# EAGLE schematic FlatSat_Final (EAGLE 9.6.2)
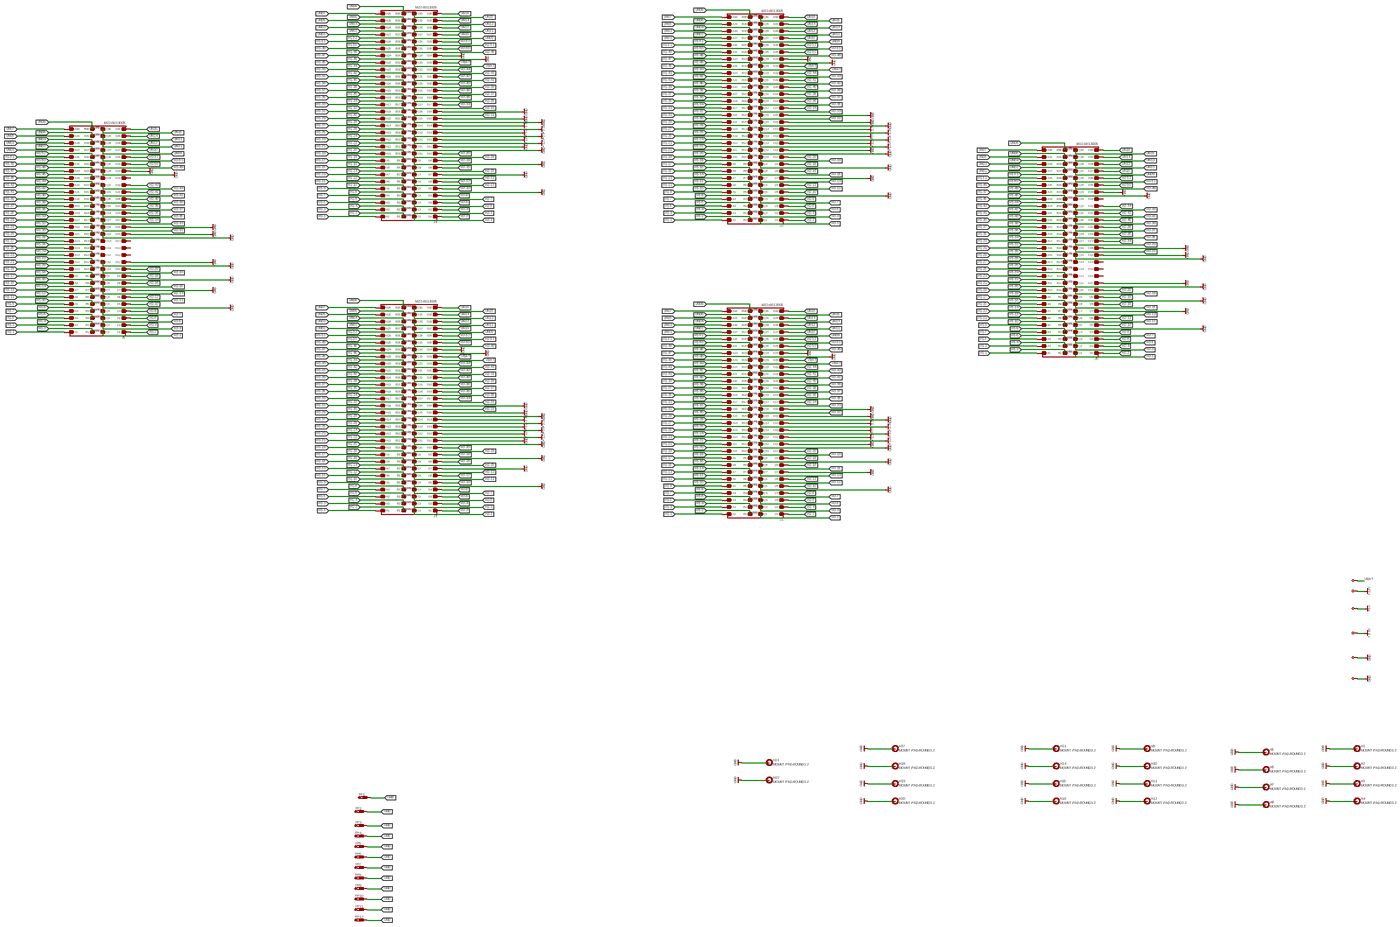
[diagram p0: schematic, sheet 1, overview]
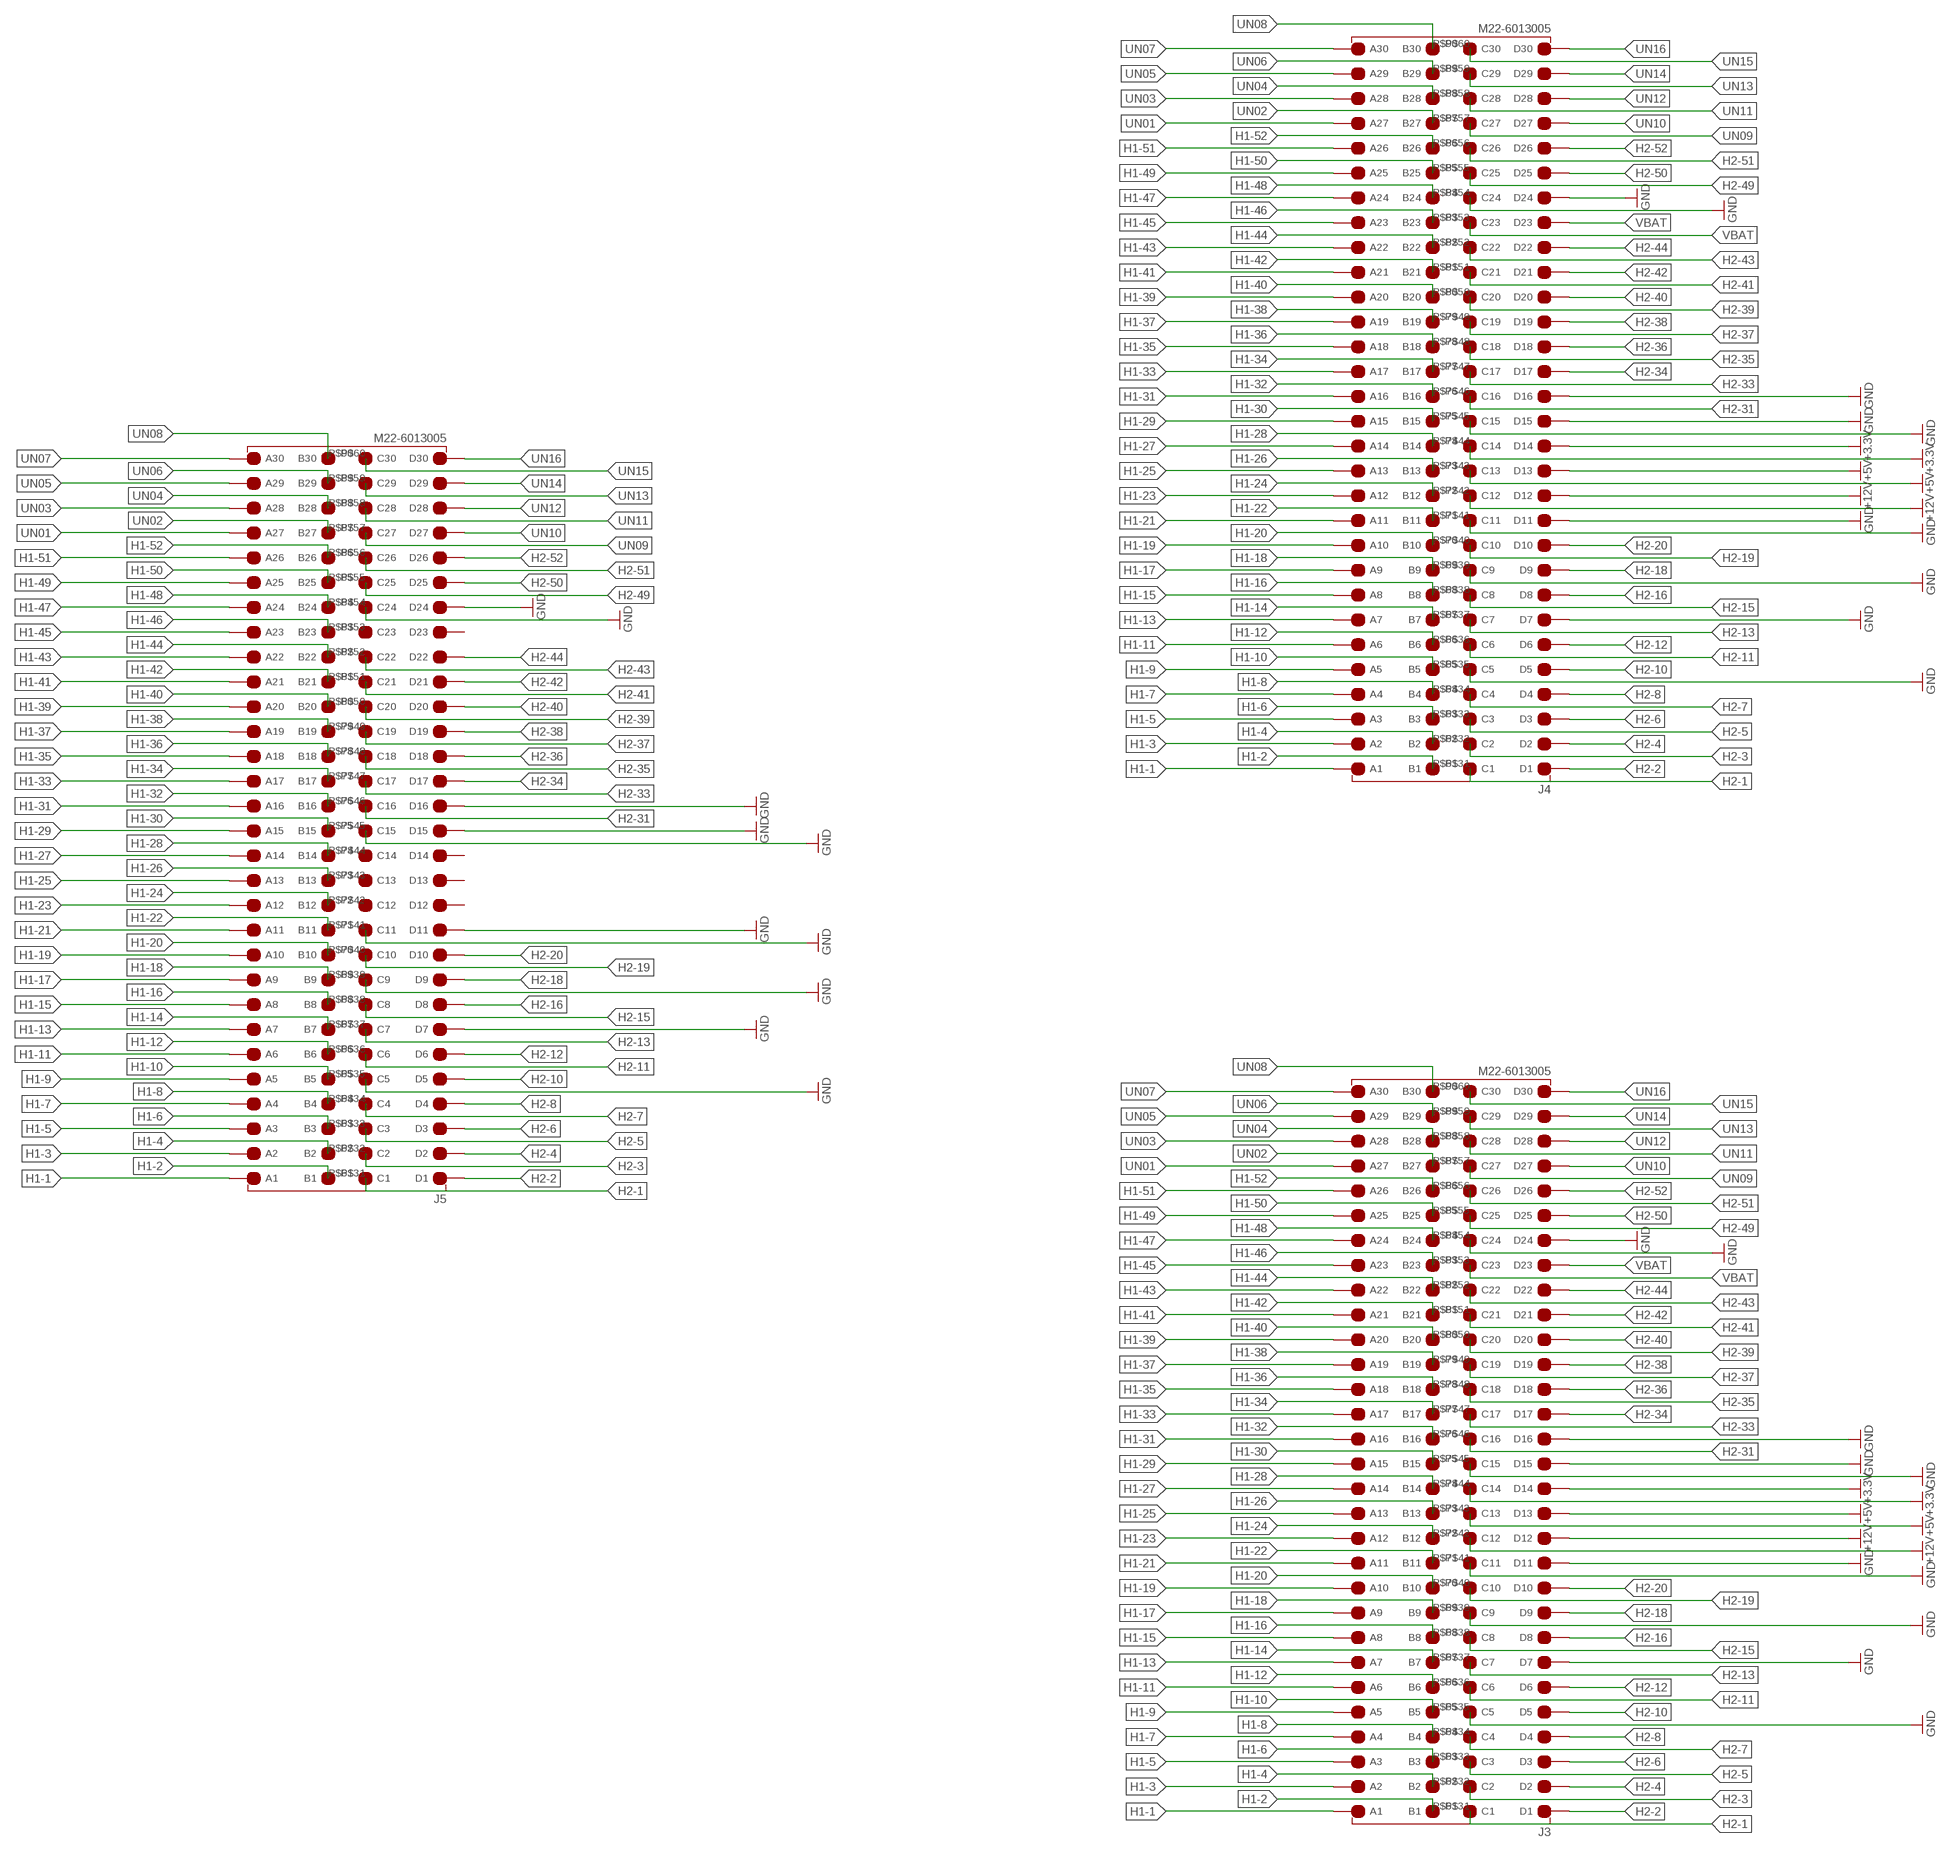
[diagram p1: schematic, sheet 1, part 1 of 5]
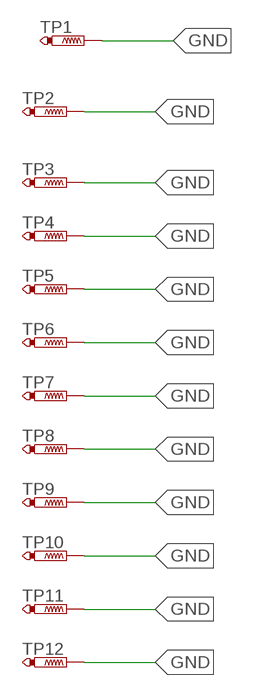
[diagram p2: schematic, sheet 1, part 2 of 5]
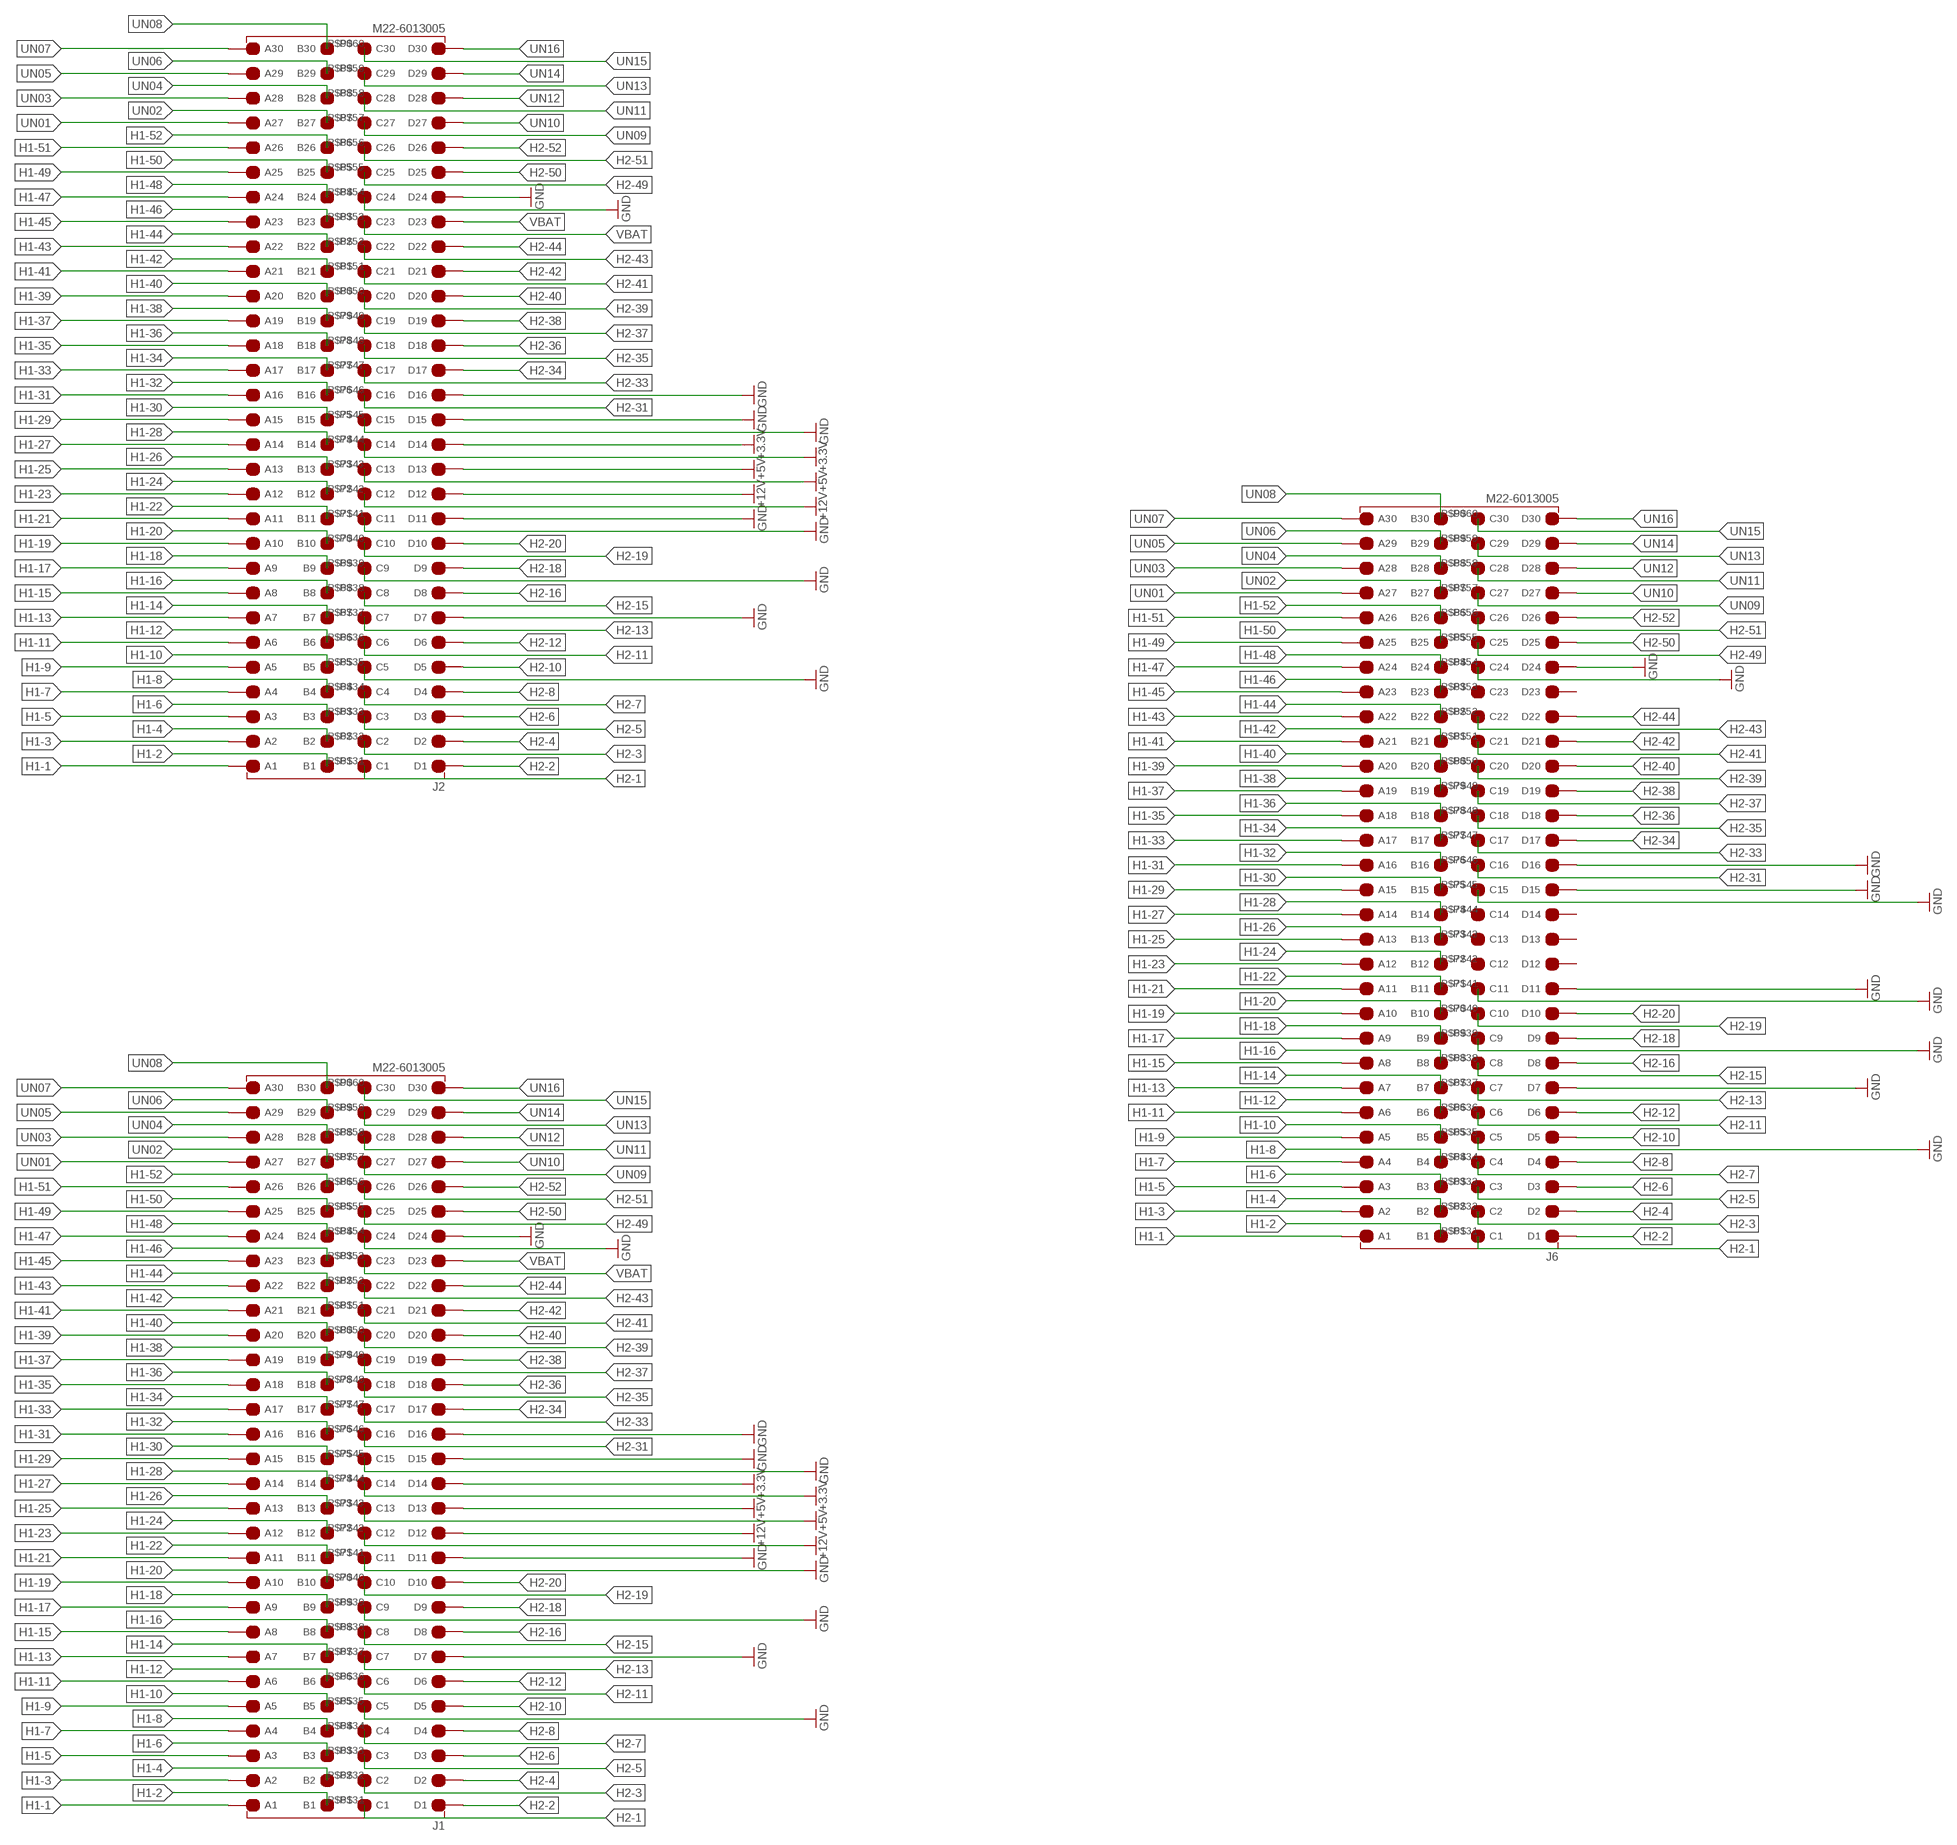
[diagram p3: schematic, sheet 1, part 3 of 5]
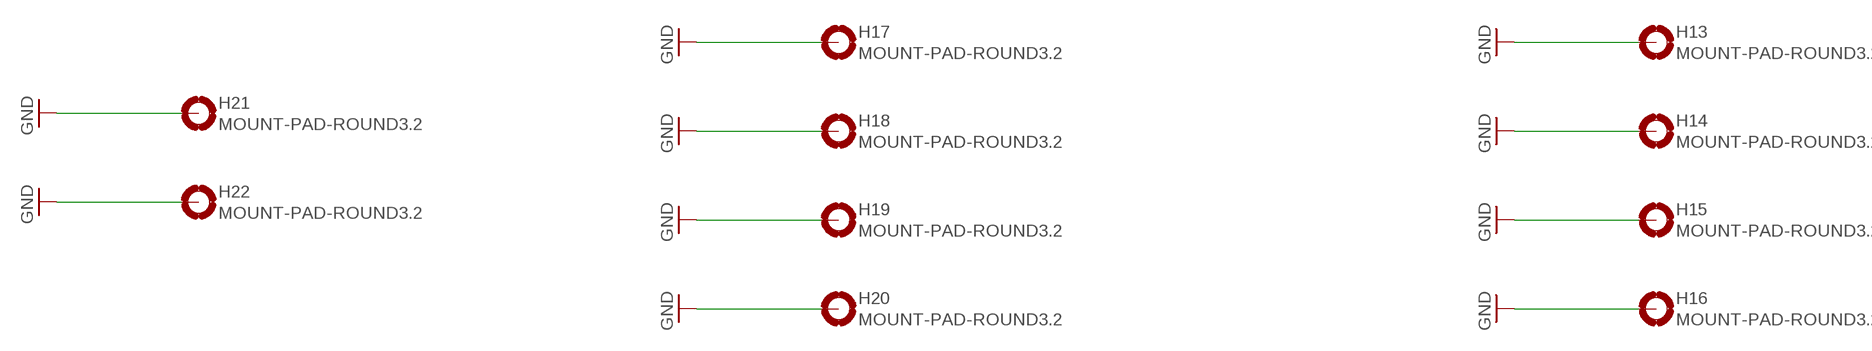
[diagram p4: schematic, sheet 1, part 4 of 5]
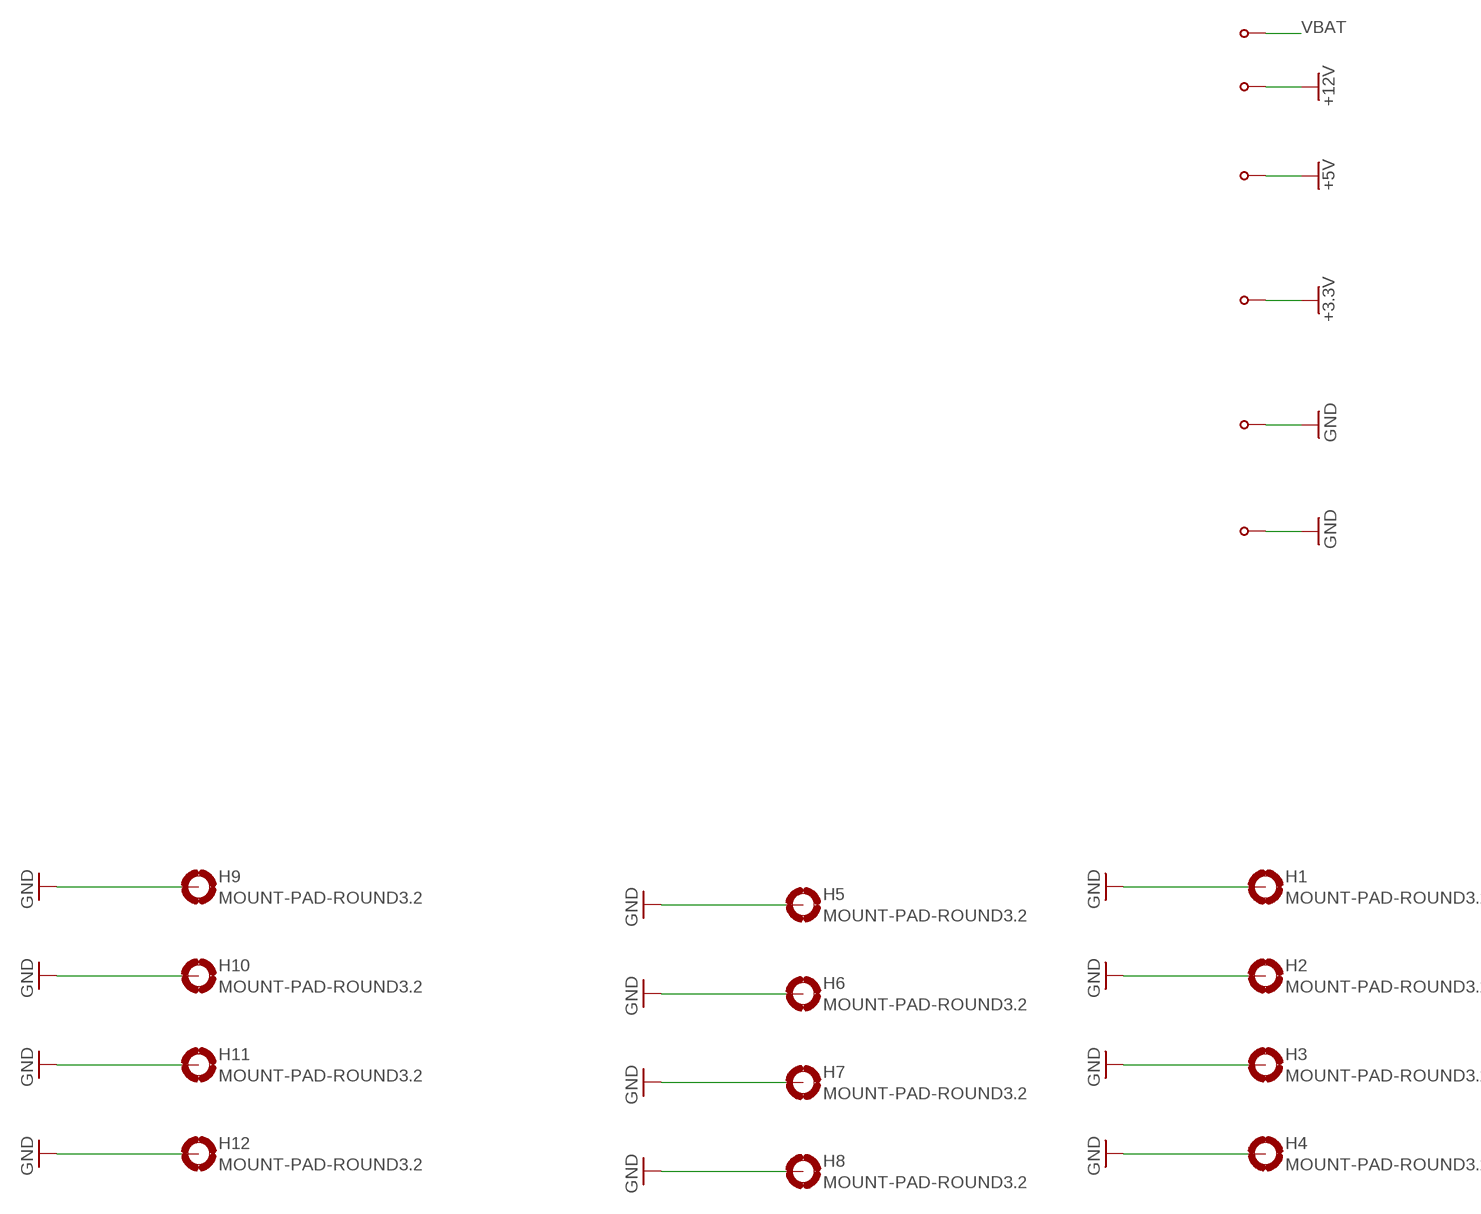
[diagram p5: schematic, sheet 1, part 5 of 5]

## Parts
H1  MOUNT-PAD-ROUND3.2  [3,2-PAD]
H2  MOUNT-PAD-ROUND3.2  [3,2-PAD]
H3  MOUNT-PAD-ROUND3.2  [3,2-PAD]
H4  MOUNT-PAD-ROUND3.2  [3,2-PAD]
H5  MOUNT-PAD-ROUND3.2  [3,2-PAD]
H6  MOUNT-PAD-ROUND3.2  [3,2-PAD]
H7  MOUNT-PAD-ROUND3.2  [3,2-PAD]
H8  MOUNT-PAD-ROUND3.2  [3,2-PAD]
H9  MOUNT-PAD-ROUND3.2  [3,2-PAD]
H10  MOUNT-PAD-ROUND3.2  [3,2-PAD]
H11  MOUNT-PAD-ROUND3.2  [3,2-PAD]
H12  MOUNT-PAD-ROUND3.2  [3,2-PAD]
H13  MOUNT-PAD-ROUND3.2  [3,2-PAD]
H14  MOUNT-PAD-ROUND3.2  [3,2-PAD]
H15  MOUNT-PAD-ROUND3.2  [3,2-PAD]
H16  MOUNT-PAD-ROUND3.2  [3,2-PAD]
H17  MOUNT-PAD-ROUND3.2  [3,2-PAD]
H18  MOUNT-PAD-ROUND3.2  [3,2-PAD]
H19  MOUNT-PAD-ROUND3.2  [3,2-PAD]
H20  MOUNT-PAD-ROUND3.2  [3,2-PAD]
H21  MOUNT-PAD-ROUND3.2  [3,2-PAD]
H22  MOUNT-PAD-ROUND3.2  [3,2-PAD]
J1  M22-6013005  [RHDR120W55P200_4X30_6020X820X9]
J2  M22-6013005  [RHDR120W55P200_4X30_6020X820X9]
J3  M22-6013005  [RHDR120W55P200_4X30_6020X820X9]
J4  M22-6013005  [RHDR120W55P200_4X30_6020X820X9]
J5  M22-6013005  [RHDR120W55P200_4X30_6020X820X9]
J6  M22-6013005  [RHDR120W55P200_4X30_6020X820X9]
TP1  PTR1PAD1-13  [P1-13]
TP2  PTR1PAD1-13  [P1-13]
TP3  PTR1PAD1-13  [P1-13]
TP4  PTR1PAD1-13  [P1-13]
TP5  PTR1PAD1-13  [P1-13]
TP6  PTR1PAD1-13  [P1-13]
TP7  PTR1PAD1-13  [P1-13]
TP8  PTR1PAD1-13  [P1-13]
TP9  PTR1PAD1-13  [P1-13]
TP10  PTR1PAD1-13  [P1-13]
TP11  PTR1PAD1-13  [P1-13]
TP12  PTR1PAD1-13  [P1-13]
U$1  BANANA-JACK  [BANANA-PRINT]
U$2  BANANA-JACK  [BANANA-PRINT]
U$3  BANANA-JACK  [BANANA-PRINT]
U$4  BANANA-JACK  [BANANA-PRINT]
U$5  BANANA-JACK  [BANANA-PRINT]
U$6  BANANA-JACK  [BANANA-PRINT]

## Nets
+3.3V: J1.P$14(D14) J1.P$44(C14) J2.P$14(D14) J2.P$44(C14) J3.P$14(D14) J3.P$44(C14) J4.P$14(D14) J4.P$44(C14) U$3.P$1(PIN)
+5V: J1.P$13(D13) J1.P$43(C13) J2.P$13(D13) J2.P$43(C13) J3.P$13(D13) J3.P$43(C13) J4.P$13(D13) J4.P$43(C13) U$2.P$1(PIN)
+12V: J1.P$12(D12) J1.P$42(C12) J2.P$12(D12) J2.P$42(C12) J3.P$12(D12) J3.P$42(C12) J4.P$12(D12) J4.P$42(C12) U$1.P$1(PIN)
GND: H1.B3,2(MOUNT) H2.B3,2(MOUNT) H3.B3,2(MOUNT) H4.B3,2(MOUNT) H5.B3,2(MOUNT) H6.B3,2(MOUNT) H7.B3,2(MOUNT) H8.B3,2(MOUNT) H9.B3,2(MOUNT) H10.B3,2(MOUNT) H11.B3,2(MOUNT) H12.B3,2(MOUNT) H13.B3,2(MOUNT) H14.B3,2(MOUNT) H15.B3,2(MOUNT) H16.B3,2(MOUNT) H17.B3,2(MOUNT) H18.B3,2(MOUNT) H19.B3,2(MOUNT) H20.B3,2(MOUNT) H21.B3,2(MOUNT) H22.B3,2(MOUNT) J1.P$7(D7) J1.P$11(D11) J1.P$15(D15) J1.P$16(D16) J1.P$24(D24) J1.P$35(C5) J1.P$39(C9) J1.P$41(C11) J1.P$45(C15) J1.P$54(C24) J2.P$7(D7) J2.P$11(D11) J2.P$15(D15) J2.P$16(D16) J2.P$24(D24) J2.P$35(C5) J2.P$39(C9) J2.P$41(C11) J2.P$45(C15) J2.P$54(C24) J3.P$7(D7) J3.P$11(D11) J3.P$15(D15) J3.P$16(D16) J3.P$24(D24) J3.P$35(C5) J3.P$39(C9) J3.P$41(C11) J3.P$45(C15) J3.P$54(C24) J4.P$7(D7) J4.P$11(D11) J4.P$15(D15) J4.P$16(D16) J4.P$24(D24) J4.P$35(C5) J4.P$39(C9) J4.P$41(C11) J4.P$45(C15) J4.P$54(C24) J5.P$7(D7) J5.P$11(D11) J5.P$15(D15) J5.P$16(D16) J5.P$24(D24) J5.P$35(C5) J5.P$39(C9) J5.P$41(C11) J5.P$45(C15) J5.P$54(C24) J6.P$7(D7) J6.P$11(D11) J6.P$15(D15) J6.P$16(D16) J6.P$24(D24) J6.P$35(C5) J6.P$39(C9) J6.P$41(C11) J6.P$45(C15) J6.P$54(C24) TP1.TP TP2.TP TP3.TP TP4.TP TP5.TP TP6.TP TP7.TP TP8.TP TP9.TP TP10.TP TP11.TP TP12.TP U$4.P$1(PIN) U$5.P$1(PIN)
H1-1: J1.P$91(A1) J2.P$91(A1) J3.P$91(A1) J4.P$91(A1) J5.P$91(A1) J6.P$91(A1)
H1-2: J1.P$61(B1) J2.P$61(B1) J3.P$61(B1) J4.P$61(B1) J5.P$61(B1) J6.P$61(B1)
H1-3: J1.P$92(A2) J2.P$92(A2) J3.P$92(A2) J4.P$92(A2) J5.P$92(A2) J6.P$92(A2)
H1-4: J1.P$62(B2) J2.P$62(B2) J3.P$62(B2) J4.P$62(B2) J5.P$62(B2) J6.P$62(B2)
H1-5: J1.P$93(A3) J2.P$93(A3) J3.P$93(A3) J4.P$93(A3) J5.P$93(A3) J6.P$93(A3)
H1-6: J1.P$63(B3) J2.P$63(B3) J3.P$63(B3) J4.P$63(B3) J5.P$63(B3) J6.P$63(B3)
H1-7: J1.P$94(A4) J2.P$94(A4) J3.P$94(A4) J4.P$94(A4) J5.P$94(A4) J6.P$94(A4)
H1-8: J1.P$64(B4) J2.P$64(B4) J3.P$64(B4) J4.P$64(B4) J5.P$64(B4) J6.P$64(B4)
H1-9: J1.P$95(A5) J2.P$95(A5) J3.P$95(A5) J4.P$95(A5) J5.P$95(A5) J6.P$95(A5)
H1-10: J1.P$65(B5) J2.P$65(B5) J3.P$65(B5) J4.P$65(B5) J5.P$65(B5) J6.P$65(B5)
H1-11: J1.P$96(A6) J2.P$96(A6) J3.P$96(A6) J4.P$96(A6) J5.P$96(A6) J6.P$96(A6)
H1-12: J1.P$66(B6) J2.P$66(B6) J3.P$66(B6) J4.P$66(B6) J5.P$66(B6) J6.P$66(B6)
H1-13: J1.P$97(A7) J2.P$97(A7) J3.P$97(A7) J4.P$97(A7) J5.P$97(A7) J6.P$97(A7)
H1-14: J1.P$67(B7) J2.P$67(B7) J3.P$67(B7) J4.P$67(B7) J5.P$67(B7) J6.P$67(B7)
H1-15: J1.P$98(A8) J2.P$98(A8) J3.P$98(A8) J4.P$98(A8) J5.P$98(A8) J6.P$98(A8)
H1-16: J1.P$68(B8) J2.P$68(B8) J3.P$68(B8) J4.P$68(B8) J5.P$68(B8) J6.P$68(B8)
H1-17: J1.P$99(A9) J2.P$99(A9) J3.P$99(A9) J4.P$99(A9) J5.P$99(A9) J6.P$99(A9)
H1-18: J1.P$69(B9) J2.P$69(B9) J3.P$69(B9) J4.P$69(B9) J5.P$69(B9) J6.P$69(B9)
H1-19: J1.P$100(A10) J2.P$100(A10) J3.P$100(A10) J4.P$100(A10) J5.P$100(A10) J6.P$100(A10)
H1-20: J1.P$70(B10) J2.P$70(B10) J3.P$70(B10) J4.P$70(B10) J5.P$70(B10) J6.P$70(B10)
H1-21: J1.P$101(A11) J2.P$101(A11) J3.P$101(A11) J4.P$101(A11) J5.P$101(A11) J6.P$101(A11)
H1-22: J1.P$71(B11) J2.P$71(B11) J3.P$71(B11) J4.P$71(B11) J5.P$71(B11) J6.P$71(B11)
H1-23: J1.P$102(A12) J2.P$102(A12) J3.P$102(A12) J4.P$102(A12) J5.P$102(A12) J6.P$102(A12)
H1-24: J1.P$72(B12) J2.P$72(B12) J3.P$72(B12) J4.P$72(B12) J5.P$72(B12) J6.P$72(B12)
H1-25: J1.P$103(A13) J2.P$103(A13) J3.P$103(A13) J4.P$103(A13) J5.P$103(A13) J6.P$103(A13)
H1-26: J1.P$73(B13) J2.P$73(B13) J3.P$73(B13) J4.P$73(B13) J5.P$73(B13) J6.P$73(B13)
H1-27: J1.P$104(A14) J2.P$104(A14) J3.P$104(A14) J4.P$104(A14) J5.P$104(A14) J6.P$104(A14)
H1-28: J1.P$74(B14) J2.P$74(B14) J3.P$74(B14) J4.P$74(B14) J5.P$74(B14) J6.P$74(B14)
H1-29: J1.P$105(A15) J2.P$105(A15) J3.P$105(A15) J4.P$105(A15) J5.P$105(A15) J6.P$105(A15)
H1-30: J1.P$75(B15) J2.P$75(B15) J3.P$75(B15) J4.P$75(B15) J5.P$75(B15) J6.P$75(B15)
H1-31: J1.P$106(A16) J2.P$106(A16) J3.P$106(A16) J4.P$106(A16) J5.P$106(A16) J6.P$106(A16)
H1-32: J1.P$76(B16) J2.P$76(B16) J3.P$76(B16) J4.P$76(B16) J5.P$76(B16) J6.P$76(B16)
H1-33: J1.P$107(A17) J2.P$107(A17) J3.P$107(A17) J4.P$107(A17) J5.P$107(A17) J6.P$107(A17)
H1-34: J1.P$77(B17) J2.P$77(B17) J3.P$77(B17) J4.P$77(B17) J5.P$77(B17) J6.P$77(B17)
H1-35: J1.P$108(A18) J2.P$108(A18) J3.P$108(A18) J4.P$108(A18) J5.P$108(A18) J6.P$108(A18)
H1-36: J1.P$78(B18) J2.P$78(B18) J3.P$78(B18) J4.P$78(B18) J5.P$78(B18) J6.P$78(B18)
H1-37: J1.P$109(A19) J2.P$109(A19) J3.P$109(A19) J4.P$109(A19) J5.P$109(A19) J6.P$109(A19)
H1-38: J1.P$79(B19) J2.P$79(B19) J3.P$79(B19) J4.P$79(B19) J5.P$79(B19) J6.P$79(B19)
H1-39: J1.P$110(A20) J2.P$110(A20) J3.P$110(A20) J4.P$110(A20) J5.P$110(A20) J6.P$110(A20)
H1-40: J1.P$80(B20) J2.P$80(B20) J3.P$80(B20) J4.P$80(B20) J5.P$80(B20) J6.P$80(B20)
H1-41: J1.P$111(A21) J2.P$111(A21) J3.P$111(A21) J4.P$111(A21) J5.P$111(A21) J6.P$111(A21)
H1-42: J1.P$81(B21) J2.P$81(B21) J3.P$81(B21) J4.P$81(B21) J5.P$81(B21) J6.P$81(B21)
H1-43: J1.P$112(A22) J2.P$112(A22) J3.P$112(A22) J4.P$112(A22) J5.P$112(A22) J6.P$112(A22)
H1-44: J1.P$82(B22) J2.P$82(B22) J3.P$82(B22) J4.P$82(B22) J5.P$82(B22) J6.P$82(B22)
H1-45: J1.P$113(A23) J2.P$113(A23) J3.P$113(A23) J4.P$113(A23) J5.P$113(A23) J6.P$113(A23)
H1-46: J1.P$83(B23) J2.P$83(B23) J3.P$83(B23) J4.P$83(B23) J5.P$83(B23) J6.P$83(B23)
H1-47: J1.P$114(A24) J2.P$114(A24) J3.P$114(A24) J4.P$114(A24) J5.P$114(A24) J6.P$114(A24)
H1-48: J1.P$84(B24) J2.P$84(B24) J3.P$84(B24) J4.P$84(B24) J5.P$84(B24) J6.P$84(B24)
H1-49: J1.P$115(A25) J2.P$115(A25) J3.P$115(A25) J4.P$115(A25) J5.P$115(A25) J6.P$115(A25)
H1-50: J1.P$85(B25) J2.P$85(B25) J3.P$85(B25) J4.P$85(B25) J5.P$85(B25) J6.P$85(B25)
H1-51: J1.P$116(A26) J2.P$116(A26) J3.P$116(A26) J4.P$116(A26) J5.P$116(A26) J6.P$116(A26)
H1-52: J1.P$86(B26) J2.P$86(B26) J3.P$86(B26) J4.P$86(B26) J5.P$86(B26) J6.P$86(B26)
H2-1: J1.P$31(C1) J2.P$31(C1) J3.P$31(C1) J4.P$31(C1) J5.P$31(C1) J6.P$31(C1)
H2-2: J1.P$1(D1) J2.P$1(D1) J3.P$1(D1) J4.P$1(D1) J5.P$1(D1) J6.P$1(D1)
H2-3: J1.P$32(C2) J2.P$32(C2) J3.P$32(C2) J4.P$32(C2) J5.P$32(C2) J6.P$32(C2)
H2-4: J1.P$2(D2) J2.P$2(D2) J3.P$2(D2) J4.P$2(D2) J5.P$2(D2) J6.P$2(D2)
H2-5: J1.P$33(C3) J2.P$33(C3) J3.P$33(C3) J4.P$33(C3) J5.P$33(C3) J6.P$33(C3)
H2-6: J1.P$3(D3) J2.P$3(D3) J3.P$3(D3) J4.P$3(D3) J5.P$3(D3) J6.P$3(D3)
H2-7: J1.P$34(C4) J2.P$34(C4) J3.P$34(C4) J4.P$34(C4) J5.P$34(C4) J6.P$34(C4)
H2-8: J1.P$4(D4) J2.P$4(D4) J3.P$4(D4) J4.P$4(D4) J5.P$4(D4) J6.P$4(D4)
H2-10: J1.P$5(D5) J2.P$5(D5) J3.P$5(D5) J4.P$5(D5) J5.P$5(D5) J6.P$5(D5)
H2-11: J1.P$36(C6) J2.P$36(C6) J3.P$36(C6) J4.P$36(C6) J5.P$36(C6) J6.P$36(C6)
H2-12: J1.P$6(D6) J2.P$6(D6) J3.P$6(D6) J4.P$6(D6) J5.P$6(D6) J6.P$6(D6)
H2-13: J1.P$37(C7) J2.P$37(C7) J3.P$37(C7) J4.P$37(C7) J5.P$37(C7) J6.P$37(C7)
H2-15: J1.P$38(C8) J2.P$38(C8) J3.P$38(C8) J4.P$38(C8) J5.P$38(C8) J6.P$38(C8)
H2-16: J1.P$8(D8) J2.P$8(D8) J3.P$8(D8) J4.P$8(D8) J5.P$8(D8) J6.P$8(D8)
H2-18: J1.P$9(D9) J2.P$9(D9) J3.P$9(D9) J4.P$9(D9) J5.P$9(D9) J6.P$9(D9)
H2-19: J1.P$40(C10) J2.P$40(C10) J3.P$40(C10) J4.P$40(C10) J5.P$40(C10) J6.P$40(C10)
H2-20: J1.P$10(D10) J2.P$10(D10) J3.P$10(D10) J4.P$10(D10) J5.P$10(D10) J6.P$10(D10)
H2-31: J1.P$46(C16) J2.P$46(C16) J3.P$46(C16) J4.P$46(C16) J5.P$46(C16) J6.P$46(C16)
H2-33: J1.P$47(C17) J2.P$47(C17) J3.P$47(C17) J4.P$47(C17) J5.P$47(C17) J6.P$47(C17)
H2-34: J1.P$17(D17) J2.P$17(D17) J3.P$17(D17) J4.P$17(D17) J5.P$17(D17) J6.P$17(D17)
H2-35: J1.P$48(C18) J2.P$48(C18) J3.P$48(C18) J4.P$48(C18) J5.P$48(C18) J6.P$48(C18)
H2-36: J1.P$18(D18) J2.P$18(D18) J3.P$18(D18) J4.P$18(D18) J5.P$18(D18) J6.P$18(D18)
H2-37: J1.P$49(C19) J2.P$49(C19) J3.P$49(C19) J4.P$49(C19) J5.P$49(C19) J6.P$49(C19)
H2-38: J1.P$19(D19) J2.P$19(D19) J3.P$19(D19) J4.P$19(D19) J5.P$19(D19) J6.P$19(D19)
H2-39: J1.P$50(C20) J2.P$50(C20) J3.P$50(C20) J4.P$50(C20) J5.P$50(C20) J6.P$50(C20)
H2-40: J1.P$20(D20) J2.P$20(D20) J3.P$20(D20) J4.P$20(D20) J5.P$20(D20) J6.P$20(D20)
H2-41: J1.P$51(C21) J2.P$51(C21) J3.P$51(C21) J4.P$51(C21) J5.P$51(C21) J6.P$51(C21)
H2-42: J1.P$21(D21) J2.P$21(D21) J3.P$21(D21) J4.P$21(D21) J5.P$21(D21) J6.P$21(D21)
H2-43: J1.P$52(C22) J2.P$52(C22) J3.P$52(C22) J4.P$52(C22) J5.P$52(C22) J6.P$52(C22)
H2-44: J1.P$22(D22) J2.P$22(D22) J3.P$22(D22) J4.P$22(D22) J5.P$22(D22) J6.P$22(D22)
H2-49: J1.P$55(C25) J2.P$55(C25) J3.P$55(C25) J4.P$55(C25) J5.P$55(C25) J6.P$55(C25)
H2-50: J1.P$25(D25) J2.P$25(D25) J3.P$25(D25) J4.P$25(D25) J5.P$25(D25) J6.P$25(D25)
H2-51: J1.P$56(C26) J2.P$56(C26) J3.P$56(C26) J4.P$56(C26) J5.P$56(C26) J6.P$56(C26)
H2-52: J1.P$26(D26) J2.P$26(D26) J3.P$26(D26) J4.P$26(D26) J5.P$26(D26) J6.P$26(D26)
UN01: J1.P$117(A27) J2.P$117(A27) J3.P$117(A27) J4.P$117(A27) J5.P$117(A27) J6.P$117(A27)
UN02: J1.P$87(B27) J2.P$87(B27) J3.P$87(B27) J4.P$87(B27) J5.P$87(B27) J6.P$87(B27)
UN03: J1.P$118(A28) J2.P$118(A28) J3.P$118(A28) J4.P$118(A28) J5.P$118(A28) J6.P$118(A28)
UN04: J1.P$88(B28) J2.P$88(B28) J3.P$88(B28) J4.P$88(B28) J5.P$88(B28) J6.P$88(B28)
UN05: J1.P$119(A29) J2.P$119(A29) J3.P$119(A29) J4.P$119(A29) J5.P$119(A29) J6.P$119(A29)
UN06: J1.P$89(B29) J2.P$89(B29) J3.P$89(B29) J4.P$89(B29) J5.P$89(B29) J6.P$89(B29)
UN07: J1.P$120(A30) J2.P$120(A30) J3.P$120(A30) J4.P$120(A30) J5.P$120(A30) J6.P$120(A30)
UN08: J1.P$90(B30) J2.P$90(B30) J3.P$90(B30) J4.P$90(B30) J5.P$90(B30) J6.P$90(B30)
UN09: J1.P$57(C27) J2.P$57(C27) J3.P$57(C27) J4.P$57(C27) J5.P$57(C27) J6.P$57(C27)
UN10: J1.P$27(D27) J2.P$27(D27) J3.P$27(D27) J4.P$27(D27) J5.P$27(D27) J6.P$27(D27)
UN11: J1.P$58(C28) J2.P$58(C28) J3.P$58(C28) J4.P$58(C28) J5.P$58(C28) J6.P$58(C28)
UN12: J1.P$28(D28) J2.P$28(D28) J3.P$28(D28) J4.P$28(D28) J5.P$28(D28) J6.P$28(D28)
UN13: J1.P$59(C29) J2.P$59(C29) J3.P$59(C29) J4.P$59(C29) J5.P$59(C29) J6.P$59(C29)
UN14: J1.P$29(D29) J2.P$29(D29) J3.P$29(D29) J4.P$29(D29) J5.P$29(D29) J6.P$29(D29)
UN15: J1.P$60(C30) J2.P$60(C30) J3.P$60(C30) J4.P$60(C30) J5.P$60(C30) J6.P$60(C30)
UN16: J1.P$30(D30) J2.P$30(D30) J3.P$30(D30) J4.P$30(D30) J5.P$30(D30) J6.P$30(D30)
VBAT: J1.P$23(D23) J1.P$53(C23) J2.P$23(D23) J2.P$53(C23) J3.P$23(D23) J3.P$53(C23) J4.P$23(D23) J4.P$53(C23) U$6.P$1(PIN)
Unconnected: J5.P$12(D12) J5.P$13(D13) J5.P$14(D14) J5.P$23(D23) J5.P$42(C12) J5.P$43(C13) J5.P$44(C14) J5.P$53(C23) J6.P$12(D12) J6.P$13(D13) J6.P$14(D14) J6.P$23(D23) J6.P$42(C12) J6.P$43(C13) J6.P$44(C14) J6.P$53(C23)

## Library data of the parts
H1-H22 = holes:MOUNT-PAD-ROUND: MOUNTING PAD, round
J1-J6 = M22-6013005:M22-6013005: HARWIN - M22-6013005 - PCB Receptacle, Board-to-Board, 2 mm, 4 Rows, 120 Contacts, Through Hole Mount, M22 Series Source: Datasheet <https://ms.componentsearchengine.com/Datasheets/2/M22-6013005.pdf>; DESCRIPTION: HARWIN - M22-6013005 - PCB Receptacle, Board-to-Board, 2 mm, 4 Rows, 120 Contacts, Through Hole Mount, M22 Series; HEIGHT: 9.65mm; MANUFACTURER_NAME: Harwin; MANUFACTURER_PART_NUMBER: M22-6013005
TP1-TP12 = testpad:PTR1: TEST PIN
U$1-U$6 = con-banana:BANANA-JACK